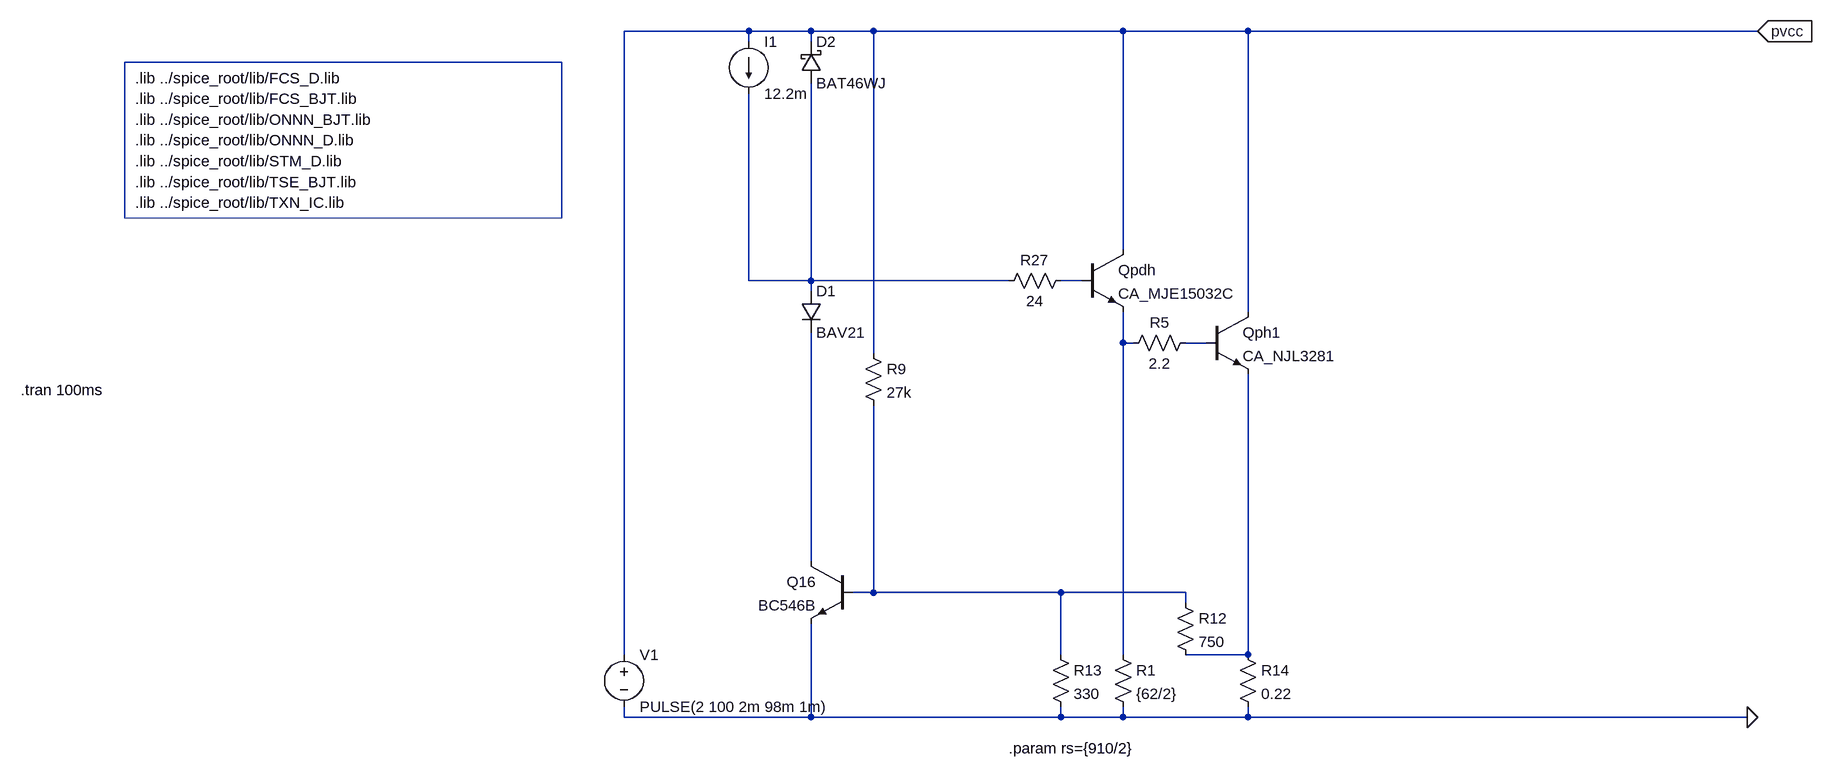
[diagram p0: schematic pab3bbb-arguo-prot-2slope.asc]
pab3bbb-arguo-prot-2slope.asc, the LTspice schematic file:
Version 4
SHEET 1 6124 2336
WIRE 1056 -1280 864 -1280
WIRE 1152 -1280 1056 -1280
WIRE 1248 -1280 1152 -1280
WIRE 1632 -1280 1248 -1280
WIRE 1824 -1280 1632 -1280
WIRE 2608 -1280 1824 -1280
WIRE 1056 -1264 1056 -1280
WIRE 1152 -1264 1152 -1280
WIRE 1632 -944 1632 -1280
WIRE 1056 -896 1056 -1184
WIRE 1152 -896 1152 -1200
WIRE 1152 -896 1056 -896
WIRE 1456 -896 1152 -896
WIRE 1568 -896 1536 -896
WIRE 1152 -880 1152 -896
WIRE 1824 -848 1824 -1280
WIRE 1632 -800 1632 -848
WIRE 1648 -800 1632 -800
WIRE 1760 -800 1728 -800
WIRE 1248 -784 1248 -1280
WIRE 1152 -464 1152 -816
WIRE 1248 -416 1248 -704
WIRE 1248 -416 1216 -416
WIRE 1536 -416 1248 -416
WIRE 1728 -416 1536 -416
WIRE 1728 -400 1728 -416
WIRE 864 -320 864 -1280
WIRE 1536 -320 1536 -416
WIRE 1632 -320 1632 -800
WIRE 1824 -320 1824 -752
WIRE 1824 -320 1728 -320
WIRE 864 -224 864 -240
WIRE 1152 -224 1152 -368
WIRE 1152 -224 864 -224
WIRE 1536 -224 1536 -240
WIRE 1536 -224 1152 -224
WIRE 1632 -224 1632 -240
WIRE 1632 -224 1536 -224
WIRE 1824 -224 1824 -240
WIRE 1824 -224 1632 -224
WIRE 2592 -224 1824 -224
FLAG 2608 -1280 pvcc
IOPIN 2608 -1280 In
FLAG 2592 -224 0
SYMBOL res 1552 -912 R90
WINDOW 0 0 56 VBottom 2
WINDOW 3 32 56 VTop 2
SYMATTR InstName R27
SYMATTR Value 24
SYMBOL npn 1760 -848 R0
SYMATTR InstName Qph1
SYMATTR Value CA_NJL3281
SYMBOL res 1744 -816 R90
WINDOW 0 0 56 VBottom 2
WINDOW 3 32 56 VTop 2
SYMATTR InstName R5
SYMATTR Value 2.2
SYMBOL res 1808 -336 R0
SYMATTR InstName R14
SYMATTR Value 0.22
SYMBOL npn 1568 -944 R0
SYMATTR InstName Qpdh
SYMATTR Value CA_MJE15032C
SYMBOL res 1616 -336 R0
SYMATTR InstName R1
SYMATTR Value {62/2}
SYMBOL npn 1216 -464 M0
SYMATTR InstName Q16
SYMATTR Value BC546B
SYMBOL schottky 1136 -1200 M180
WINDOW 0 24 64 Left 2
WINDOW 3 24 0 Left 2
SYMATTR InstName D2
SYMATTR Value BAT46WJ
SYMATTR Description Diode
SYMATTR Type diode
SYMBOL current 1056 -1264 R0
WINDOW 123 0 0 Left 0
WINDOW 39 0 0 Left 0
SYMATTR InstName I1
SYMATTR Value 12.2m
SYMBOL voltage 864 -336 R0
WINDOW 123 0 0 Left 0
WINDOW 39 0 0 Left 0
SYMATTR InstName V1
SYMATTR Value PULSE(2 100 2m 98m 1m)
SYMBOL diode 1136 -880 R0
SYMATTR InstName D1
SYMATTR Value BAV21
SYMBOL res 1712 -416 R0
SYMATTR InstName R12
SYMATTR Value 750
SYMBOL res 1232 -800 R0
SYMATTR InstName R9
SYMATTR Value 27k
SYMBOL res 1520 -336 R0
SYMATTR InstName R13
SYMATTR Value 330
TEXT 112 -1144 Left 2 !.lib ../spice_root/lib/ONNN_BJT.lib
TEXT 112 -1080 Left 2 !.lib ../spice_root/lib/STM_D.lib
TEXT 112 -1176 Left 2 !.lib ../spice_root/lib/FCS_BJT.lib
TEXT 112 -1208 Left 2 !.lib ../spice_root/lib/FCS_D.lib
TEXT 112 -1112 Left 2 !.lib ../spice_root/lib/ONNN_D.lib
TEXT 112 -1048 Left 2 !.lib ../spice_root/lib/TSE_BJT.lib
TEXT 112 -1016 Left 2 !.lib ../spice_root/lib/TXN_IC.lib
TEXT -64 -728 Left 2 !.tran 100ms
TEXT 1456 -176 Left 2 !.param rs={910/2}
RECTANGLE Normal 768 -992 96 -1232

The netlist it stands for:
* pab3bbb-arguo-prot-2slope.asc
R27 N002 N001 24
Qph1 pvcc N004 N007 0 CA_NJL3281
R5 N004 N003 2.2
R14 N007 0 0.22
Qpdh pvcc N002 N003 0 CA_MJE15032C
R1 N003 0 {62/2}
Q16 N005 N006 0 0 BC546B
D2 N001 pvcc BAT46WJ
I1 pvcc N001 12.2m
V1 pvcc 0 PULSE(2 100 2m 98m 1m)
D1 N001 N005 BAV21
R12 N006 N007 750
R9 pvcc N006 27k
R13 N006 0 330
.model D D
.lib standard.dio
.model NPN NPN
.model PNP PNP
.lib standard.bjt
.lib ../spice_root/lib/ONNN_BJT.lib
.lib ../spice_root/lib/STM_D.lib
.lib ../spice_root/lib/FCS_BJT.lib
.lib ../spice_root/lib/FCS_D.lib
.lib ../spice_root/lib/ONNN_D.lib
.lib ../spice_root/lib/TSE_BJT.lib
.lib ../spice_root/lib/TXN_IC.lib
.tran 100ms
.param rs={910/2}
.backanno
.end